# EAGLE design Branly_Pi_v4 (EAGLE 6.5.0)
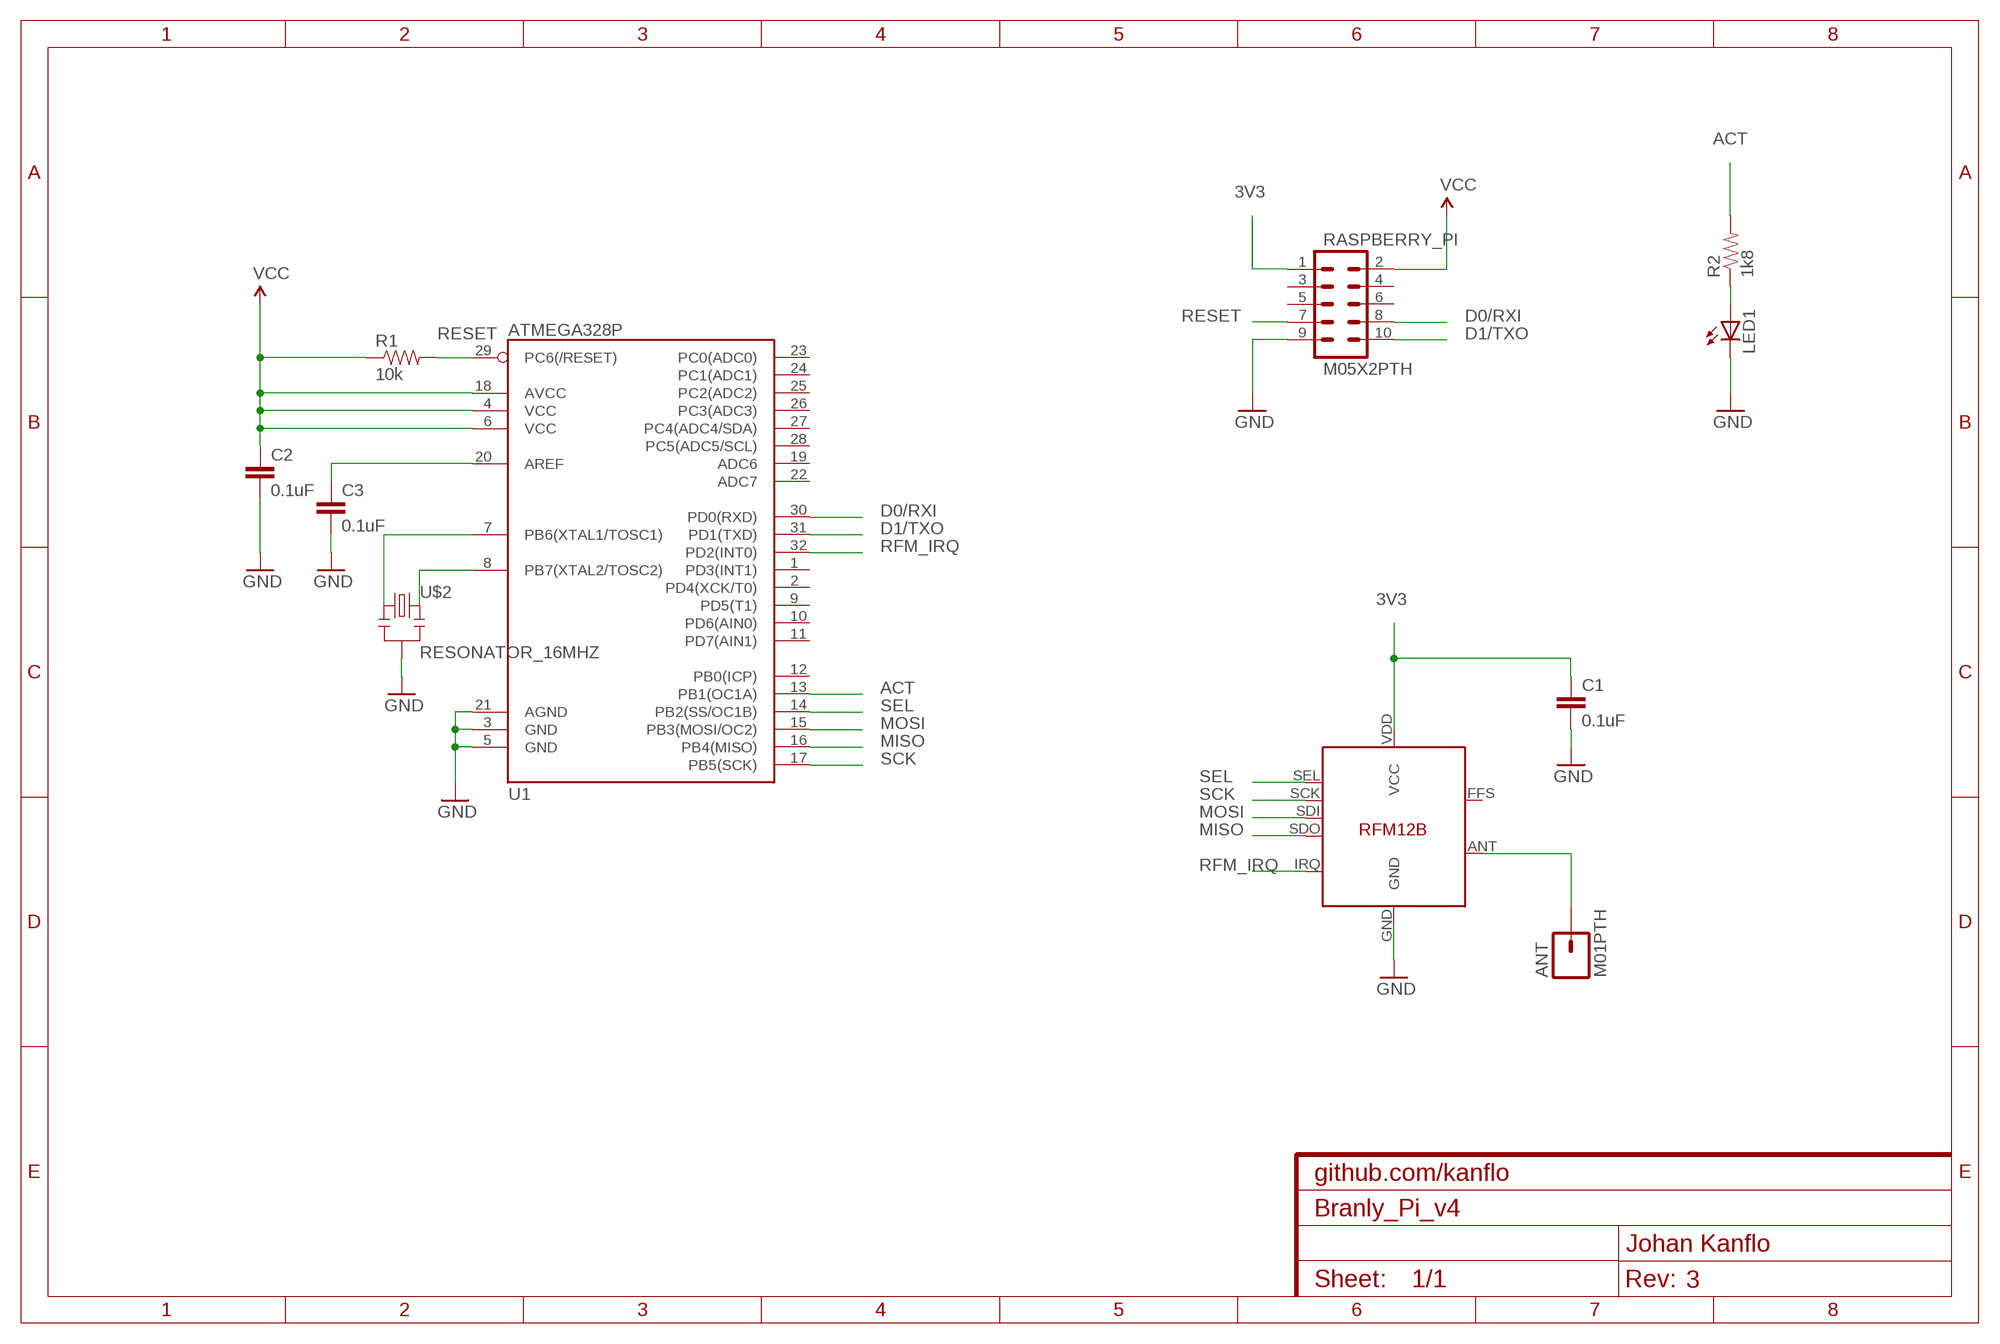
[diagram p0: schematic, sheet 1]

## Parts
ANT  M01PTH  [1X01]
C1  0.1uF  0.1UF-25V(+80/-20%)(0603)  [0603-CAP]
C2  0.1uF  0.1UF-25V(+80/-20%)(0603)  [0603-CAP]
C3  0.1uF  0.1UF-25V(+80/-20%)(0603)  [0603-CAP]
LED1  LED0603  [LED-0603]
R1  10k  RESISTOR0603-RES  [0603-RES]
R2  1k8  RESISTOR0603-RES  [0603-RES]
RASPBERRY_PI  M05X2PTH  [AVR_ICSP]
U1  ATMEGA328P  ATMEGA328_SMT  [TQFP32-08]
U2  RFM12B  [RFM12B]
U$2  RESONATOR_16MHZ  [RESONATOR_SMD]

## Nets
3V3: C1.1 RASPBERRY_PI.1 U2.VDD(VCC)
ACT: R2.2 U1.13(PB1(OC1A))
D0/RXI: RASPBERRY_PI.8 U1.30(PD0(RXD))
D1/TXO: RASPBERRY_PI.10 U1.31(PD1(TXD))
GND: C1.2 C2.2 C3.2 LED1.C RASPBERRY_PI.9 U1.3(GND) U1.5(GND) U1.21(AGND) U2.GND U$2.2
MISO: U1.16(PB4(MISO)) U2.SDO
MOSI: U1.15(PB3(MOSI/OC2)) U2.SDI
N$1: LED1.A R2.1
N$4: C3.1 U1.20(AREF)
N$5: U1.7(PB6(XTAL1/TOSC1)) U$2.1
N$6: U1.8(PB7(XTAL2/TOSC2)) U$2.3
N$18: ANT.1 U2.ANT
RESET: R1.2 RASPBERRY_PI.7 U1.29(PC6(/RESET))
RFM_IRQ: U1.32(PD2(INT0)) U2.IRQ
SCK: U1.17(PB5(SCK)) U2.SCK
SEL: U1.14(PB2(SS/OC1B)) U2.SEL
VCC: C2.1 R1.1 RASPBERRY_PI.2 U1.4(VCC) U1.6(VCC) U1.18(AVCC)
Unconnected: RASPBERRY_PI.3 RASPBERRY_PI.4 RASPBERRY_PI.5 RASPBERRY_PI.6 U1.1(PD3(INT1)) U1.2(PD4(XCK/T0)) U1.9(PD5(T1)) U1.10(PD6(AIN0)) U1.11(PD7(AIN1)) U1.12(PB0(ICP)) U1.19(ADC6) U1.22(ADC7) U1.23(PC0(ADC0)) U1.24(PC1(ADC1)) U1.25(PC2(ADC2)) U1.26(PC3(ADC3)) U1.27(PC4(ADC4/SDA)) U1.28(PC5(ADC5/SCL)) U2.FFS

## Library data of the parts
ANT = SparkFun-Connectors:M01: Header 1 Standard 1-pin 0.1" header. Use with straight break away headers (SKU : PRT-00116), right angle break away headers (PRT-00553), swiss pins (PRT-00743), machine pins (PRT-00117), and female headers (PRT-00115).
C1-C3 = SparkFun-Capacitors:0.1UF-25V(+80/-20%)(0603): CAP-00810 Ceramic Standard decoupling cap; PROD_ID: CAP-00810
LED1 = SparkFun-LED:LED: LEDs Standard schematic elements and footprints for 5mm, 3mm, 1206, and 0603 sized LEDs. 5mm - Spark Fun Electronics SKU : COM-00529 (and others)
R1 R2 = SparkFun-Passives:RESISTOR: Resistor Basic schematic elements and footprints for 0603, 1206, and PTH resistors.
RASPBERRY_PI = SparkFun-Connectors:M05X2: Header 5x2 Standard 10-pin dual row 0.1" header. Commonly used with AVR-ISP. Use with Spark Fun Electronics SKU: PRT-00778
U1 = SparkFun-DigitalIC:ATMEGA328_SMT: 32-Pin Atmega328 part Commonly used on Arduino compatible boards Available in QFP and QFN packages TQFP is IC-09069 QFN is non-stock; PROD_ID: IC-09069
U2 = JeeParts:RFM12B
U$2 = kanflo:RESONATOR_16MHZ

## Board
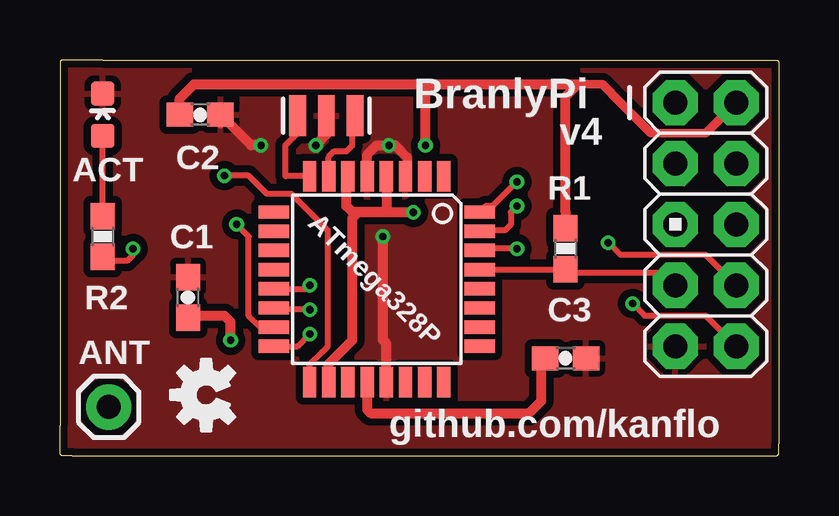
[diagram p1: board, top side]
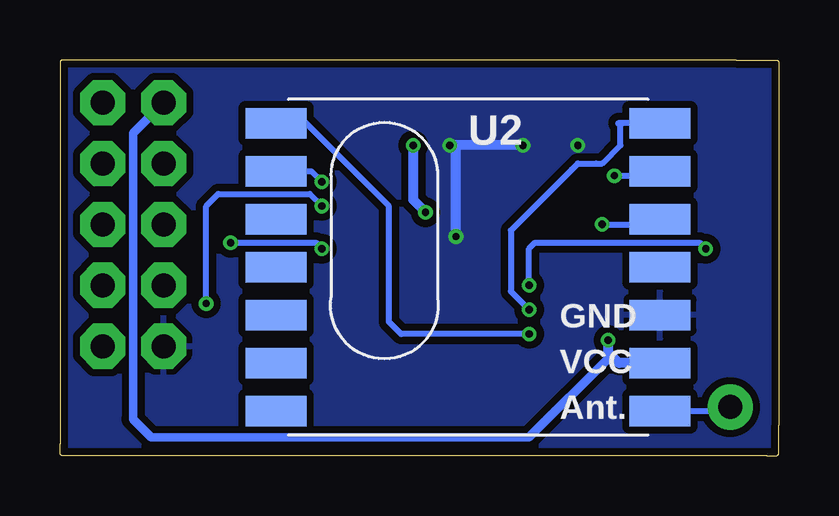
[diagram p2: board, bottom side, seen from below]

Size 29.97 x 16.51 mm. Coordinates in mm from the lower left corner, seen from the top.
Outline: 1.78,16.51 29.84,16.51 arc-90 29.97,16.38 29.97,0.51 29.97,0.13 arc-90 29.84,0 0.51,0 0.13,0 arc-90 0,0.13 0,1.27 0,16.38 arc-90 0.13,16.51 1.78,16.51
Copper layers (1*16): Top 0.035mm / dielectric 1.5mm / Bottom 0.035mm
Design rules "SeeedStudio_2layer_DRU_no_angle_20140221": minimum track width 6mil, minimum drill 12mil, track to track 6mil, track to pad 6mil, pad to pad 6mil, via to via 6mil, smd to smd 0mil, copper to edge 10mil, drill to drill 10mil, minimum pad ring 10mil, minimum via ring 6mil, stop-mask expansion 2mil, vias tented up to drill 100mil, thermal gap 10mil

### Footprints (pad centres in the part's own frame; a part is rotated, then mirrored left to right if it is on the bottom)
1X01 = drill 1 pad 1.88: 1 0,0
0603-CAP = smd 1.1 x 1: 1 -0.85,0; 2 0.85,0
LED-0603 = smd 1 x 1: A 0,-0.877; C 0,0.877
0603-RES = smd 1.1 x 1: 1 -0.85,0; 2 0.85,0
AVR_ICSP = drill 1 pad 1.88 octagon: 1 -1.27,5.08; 2 1.27,5.08; 3 -1.27,2.54; 4 1.27,2.54; 5 -1.27,0; 6 1.27,0; 7 -1.27,-2.54; 8 1.27,-2.54; 9 -1.27,-5.08; 10 1.27,-5.08
TQFP32-08 = smd 1.27 x 0.559: 1 -4.293,2.8; 2 -4.293,2; 3 -4.293,1.2; 4 -4.293,0.4; 5 -4.293,-0.4; 6 -4.293,-1.2; 7 -4.293,-2; 8 -4.293,-2.8; 17 4.293,-2.8; 18 4.293,-2; 19 4.293,-1.2; 20 4.293,-0.4; 21 4.293,0.4; 22 4.293,1.2; 23 4.293,2; 24 4.293,2.8 | smd 0.559 x 1.27: 9 -2.8,-4.293; 10 -2,-4.293; 11 -1.2,-4.293; 12 -0.4,-4.293; 13 0.4,-4.293; 14 1.2,-4.293; 15 2,-4.293; 16 2.8,-4.293; 25 2.8,4.293; 26 2,4.293; 27 1.2,4.293; 28 0.4,4.293; 29 -0.4,4.293; 30 -1.2,4.293; 31 -2,4.293; 32 -2.8,4.293
RFM12B = smd 2.54 x 1.27: ANT 8,-6; FFS -8,2; GND 8,-2; IRQ -8,4; P$8 -8,0; P$9 -8,-2; P$10 -8,-4; P$12 -8,-6; P$16 8,0; SCK 8,4; SDI 8,2; SDO -8,6; SEL 8,6; VDD 8,-4
RESONATOR_SMD = smd 0.7 x 1.7: 1 0.4,0.8; 2 1.6,0.8; 3 2.8,0.8

### Placement (x,y rotation side)
ANT  2.03,2.03 0 top
C1  5.33,6.6 90 top
C2  5.84,14.22 0 top
C3  21.08,4.06 0 top
LED1  1.78,14.22 0 top
R1  21.08,8.64 270 top
R2  1.78,9.14 270 top
RASPBERRY_PI  26.92,9.65 0 top
U1  13.21,7.37 270 top
U2  12.95,7.87 0 bottom
U$2  12.7,14.99 180 top
U$3  [OSHW-LOGO-S]  6.1,2.54 90 top

### Tracks (layer width: path | path; a pad name or v marks a point on that pad's centre or on a via)
3V3  (via drill 0.3 pad 0.25)
  Top 0.406: v7.11,4.83 7.11,5.59 6.86,5.84 5.42,5.84 C1.1
  Bottom 0.356: RASPBERRY_PI.1 26.92,13.46 26.92,1.52 26.16,0.76 10.41,0.76 6.98,4.19
  Bottom 0.406: U2.VDD 6.67,3.87 6.98,4.19 7.11,4.32 v7.11,4.83
ACT  (via drill 0.3 pad 0.25)
  Top 0.254: U1.13 10.27,6.97 v10.41,7.11 | v3.05,8.64 3.05,8.38 2.79,8.13 1.94,8.13 R2.2
  Bottom 0.254: v10.41,7.11 10.41,8.64 10.16,8.89 3.3,8.89 v3.05,8.64
D0/RXI  (via drill 0.3 pad 0.25)
  Top 0.254: RASPBERRY_PI.8 26.92,8.38 23.37,8.38 v22.86,8.89 | v19.05,8.64 17.57,8.64 U1.30
  Bottom 0.254: v22.86,8.89 19.3,8.89 v19.05,8.64
D1/TXO  (via drill 0.3 pad 0.25)
  Top 0.254: v19.05,10.41 18.8,10.16 18.8,9.65 18.54,9.4 17.53,9.4 U1.31 | RASPBERRY_PI.10 26.92,5.84 24.38,5.84 v23.88,6.35
  Bottom 0.254: v19.05,10.41 19.56,10.92 23.37,10.92 23.88,10.41 v23.88,6.35
GND  (via drill 0.3 pad 0.25)
  Top 0.305: C2.2 6.69,13.8
  Top 0.406: U1.5 12.81,12.55 13.21,12.95 v13.72,12.95 | v13.72,12.95 13.97,12.95 | 13.97,12.95 14.48,12.45 14.48,11.73 U1.3 | U$2.2 11.1,13.39 v10.67,12.95 | v13.72,12.95 13.97,12.95 | v8.38,12.95 7.96,12.95 C2.2 | U1.21 13.61,4.17 13.61,4.68 13.46,4.83 13.46,5.84 v13.46,9.14
  Bottom 0.406: v10.67,12.95 v13.72,12.95 | 13.46,12.7 v13.72,12.95 | v13.46,9.14 13.46,12.7 | 13.46,12.7 v13.72,12.95
  pour Top (isolate 0.305): 0,16.51 29.97,16.51 29.97,0 0,0
  pour Bottom (isolate 0.305): 0,16.51 29.97,16.51 29.97,0 0,0
MISO  (via drill 0.3 pad 0.25)
  Top 0.254: U1.16 9.9,4.57 v10.41,5.08
  Bottom 0.254: v10.41,5.08 15.75,5.08 16.26,5.59 16.26,10.41 19.81,13.97 20.86,13.97 U2.SDO
MOSI  (via drill 0.3 pad 0.25)
  Top 0.254: U1.15 8.35,5.37 7.87,5.84 7.87,9.14 v7.37,9.65
  Bottom 0.254: v7.37,9.65 5.18,9.65 U2.SDI
N$1
  Top 0.254: R2.1 LED1.A
N$4
  Top 0.406: U1.20 12.81,1.92 12.95,1.78 19.56,1.78 20.07,2.29 20.07,3.9 C3.1
N$5
  Top 0.254: U1.7 11.21,12.48 11.43,12.7 11.94,12.7 12.19,12.95 12.19,14.08 U$2.1
N$6
  Top 0.254: U1.8 9.42,11.66 9.4,11.68 9.4,12.95 9.91,13.46 U$2.3
N$18
  Bottom 0.254: U2.ANT 2.19,1.87 ANT.1
RESET
  Top 0.254: RASPBERRY_PI.7 25.15,7.62 21.25,7.62 R1.2 21.06,7.77 U1.29
RFM_IRQ  (via drill 0.3 pad 0.25)
  Top 0.254: v19.05,11.43 18.03,10.41 17.75,10.41 U1.32
  Bottom 0.254: U2.IRQ 19.49,11.87 v19.05,11.43
SCK  (via drill 0.3 pad 0.25)
  Top 0.254: U1.17 10.41,3.8 10.92,4.32 11.18,4.57 11.18,9.4 9.65,10.92 8.89,10.92 8.64,10.92 7.87,11.68 v6.86,11.68
  Bottom 0.254: v6.86,11.68 5.14,11.68 U2.SCK
SEL  (via drill 0.3 pad 0.25)
  Top 0.254: v10.41,6.1 8.98,6.1 U1.14
  Bottom 0.254: U2.SEL 6.7,13.87 6.6,13.78 6.6,12.95 7.37,12.19 7.62,12.19 8.38,12.19 8.64,11.94 11.18,9.4 11.18,6.86 v10.41,6.1
VCC  (via drill 0.3 pad 0.25)
  Top 0.356: RASPBERRY_PI.2 26.92,13.46 24.64,13.46 23.37,14.73 22.61,15.49 21.59,15.49
  Top 0.406: U1.4 13.61,10.31 13.46,10.16 12.45,10.16 | 12.45,10.16 12.19,10.16 | 12.19,10.16 11.94,10.41 11.94,11.59 U1.6 | C2.1 4.99,14.9 5.59,15.49 15.49,15.49 | 15.49,15.49 21.59,15.49 21.08,14.99 21.08,10.16 R1.1 | 12.19,10.16 12.45,10.16 | 12.45,10.16 v14.73,10.16 | v15.24,12.95 15.24,15.24 15.49,15.49 | U1.18 11.21,3.84 11.68,4.32 12.19,4.83 12.19,9.91 12.45,10.16
  Bottom 0.406: v14.73,10.16 15.24,10.67 v15.24,12.95

### Text on the board
tNames: BranlyPi | v4 | ACT | C2 | R1 | C1 | R2 | C3 | ATmega328P | ANT | github.com/kanflo